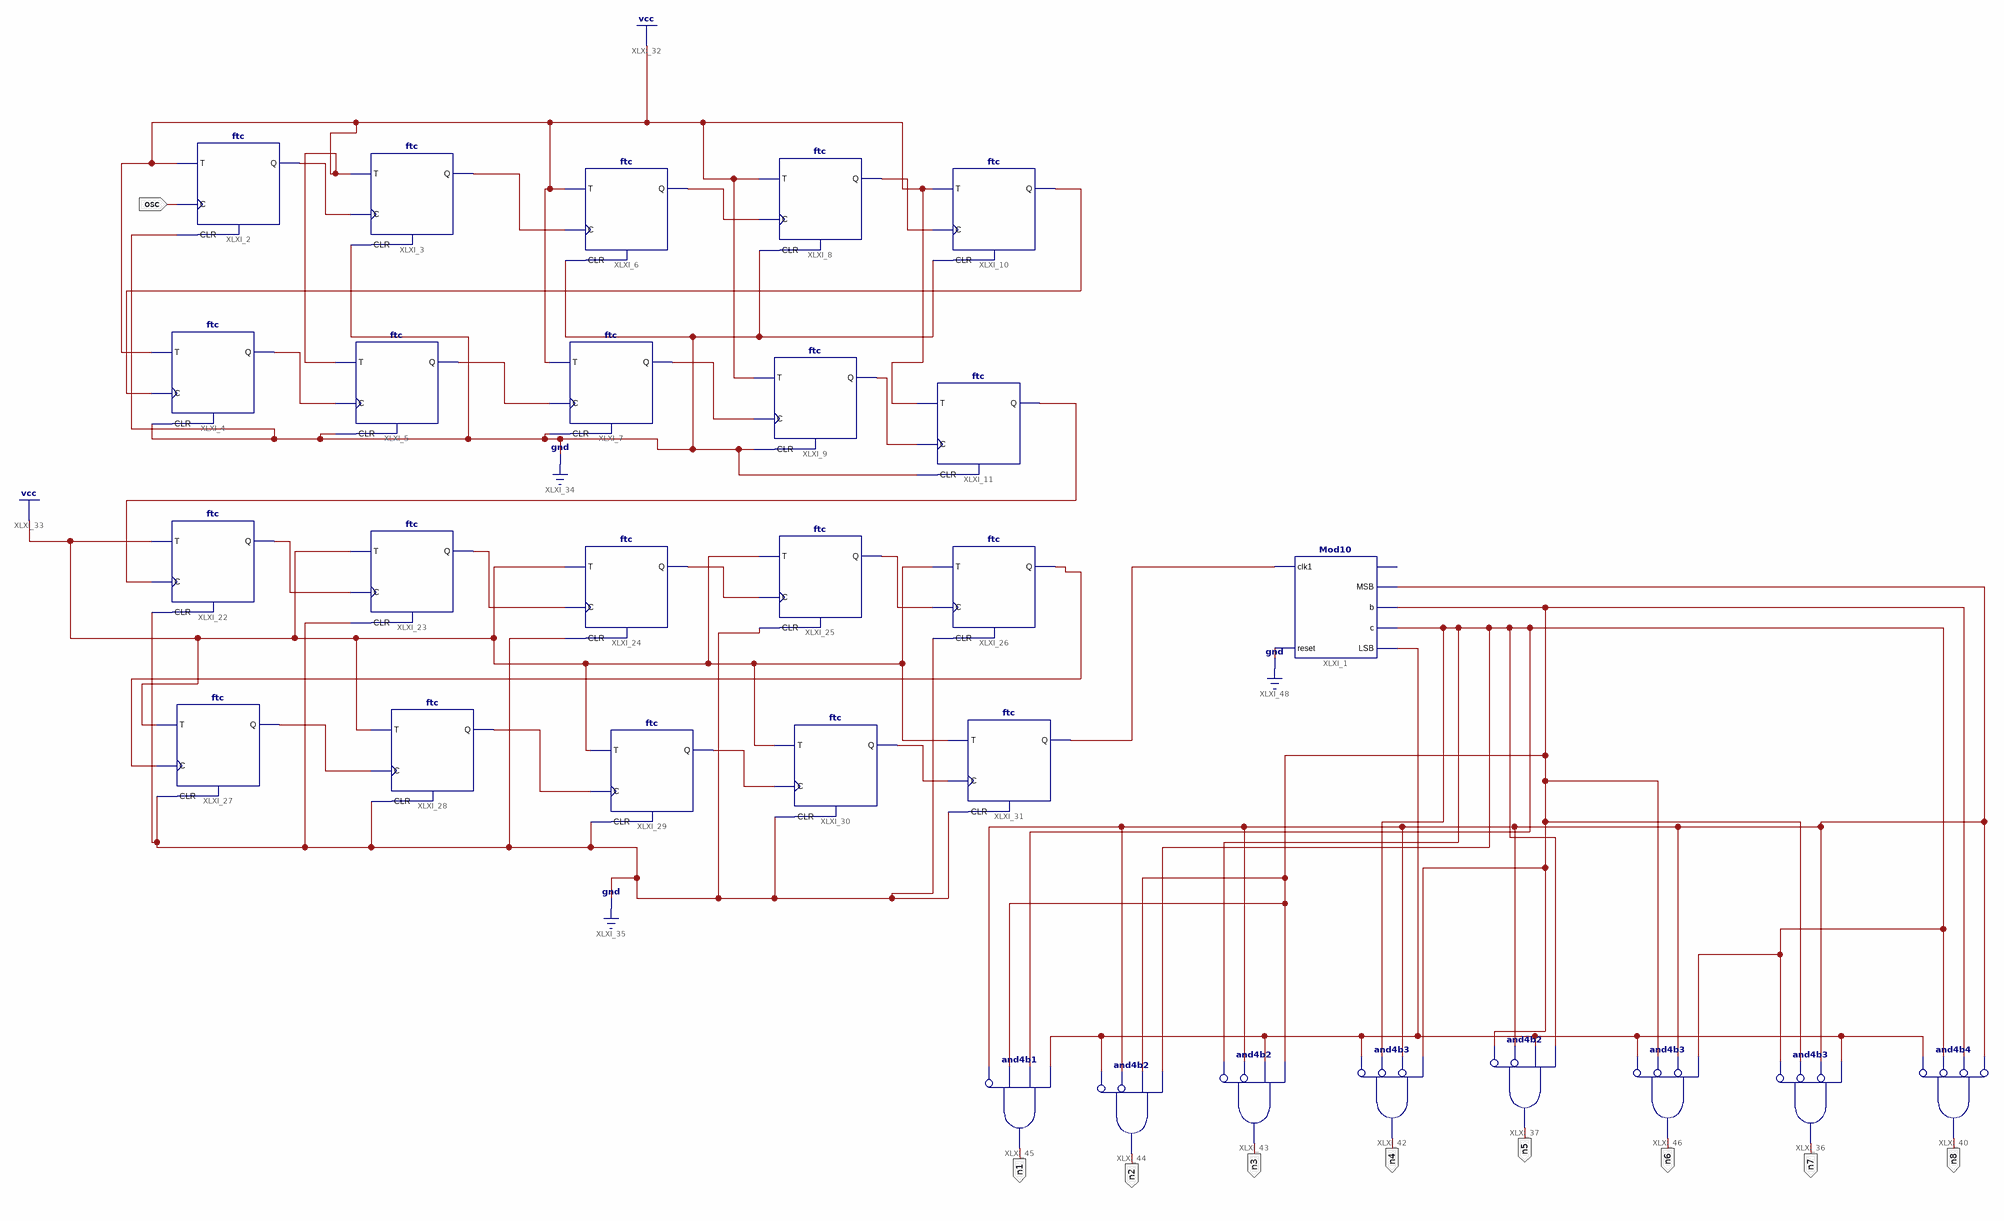
[diagram p0: schematic sheet 1]
// Xilinx ISE schematic testlab3.sch (spartan6) as structural Verilog: 29 symbols, 9 ports
module testlab3 (
  input  osc,
  output n8,
  output n7,
  output n6,
  output n5,
  output n4,
  output n3,
  output n2,
  output n1
);

  wire XLXN_4, XLXN_6, XLXN_8, XLXN_9, XLXN_10, XLXN_14, XLXN_15, XLXN_16, XLXN_17, XLXN_30, XLXN_32,
       XLXN_33, XLXN_34, XLXN_35, XLXN_36, XLXN_37, XLXN_38, XLXN_40, XLXN_41, XLXN_53, XLXN_66, XLXN_72,
       XLXN_79, XLXN_80;

  Mod10 XLXI_1 (.clk1(XLXN_53), .reset(1'b0), .MSB(XLXN_66), .b(XLXN_72), .c(XLXN_79), .LSB(XLXN_80));  // open: C_end
  ftc XLXI_2 (.C(osc), .CLR(1'b0), .T(1'b1), .Q(XLXN_4));
  ftc XLXI_3 (.C(XLXN_4), .CLR(1'b0), .T(1'b1), .Q(XLXN_6));
  ftc XLXI_4 (.C(XLXN_10), .CLR(1'b0), .T(1'b1), .Q(XLXN_14));
  ftc XLXI_5 (.C(XLXN_14), .CLR(1'b0), .T(1'b1), .Q(XLXN_15));
  ftc XLXI_6 (.C(XLXN_6), .CLR(1'b0), .T(1'b1), .Q(XLXN_8));
  ftc XLXI_7 (.C(XLXN_15), .CLR(1'b0), .T(1'b1), .Q(XLXN_16));
  ftc XLXI_8 (.C(XLXN_8), .CLR(1'b0), .T(1'b1), .Q(XLXN_9));
  ftc XLXI_9 (.C(XLXN_16), .CLR(1'b0), .T(1'b1), .Q(XLXN_17));
  ftc XLXI_10 (.C(XLXN_9), .CLR(1'b0), .T(1'b1), .Q(XLXN_10));
  ftc XLXI_11 (.C(XLXN_17), .CLR(1'b0), .T(1'b1), .Q(XLXN_30));
  ftc XLXI_22 (.C(XLXN_30), .CLR(1'b0), .T(1'b1), .Q(XLXN_32));
  ftc XLXI_23 (.C(XLXN_32), .CLR(1'b0), .T(1'b1), .Q(XLXN_33));
  ftc XLXI_24 (.C(XLXN_33), .CLR(1'b0), .T(1'b1), .Q(XLXN_34));
  ftc XLXI_25 (.C(XLXN_34), .CLR(1'b0), .T(1'b1), .Q(XLXN_35));
  ftc XLXI_26 (.C(XLXN_35), .CLR(1'b0), .T(1'b1), .Q(XLXN_36));
  ftc XLXI_27 (.C(XLXN_36), .CLR(1'b0), .T(1'b1), .Q(XLXN_37));
  ftc XLXI_28 (.C(XLXN_37), .CLR(1'b0), .T(1'b1), .Q(XLXN_38));
  ftc XLXI_29 (.C(XLXN_38), .CLR(1'b0), .T(1'b1), .Q(XLXN_40));
  ftc XLXI_30 (.C(XLXN_40), .CLR(1'b0), .T(1'b1), .Q(XLXN_41));
  ftc XLXI_31 (.C(XLXN_41), .CLR(1'b0), .T(1'b1), .Q(XLXN_53));
  and XLXI_36 (n7, ~XLXN_79, ~XLXN_72, ~XLXN_66, XLXN_80);  // and4b3
  and XLXI_37 (n5, ~XLXN_72, ~XLXN_66, XLXN_80, XLXN_79);  // and4b2
  and XLXI_40 (n8, ~XLXN_80, ~XLXN_79, ~XLXN_72, ~XLXN_66);  // and4b4
  and XLXI_42 (n4, ~XLXN_80, ~XLXN_79, ~XLXN_66, XLXN_72);  // and4b3
  and XLXI_43 (n3, ~XLXN_79, ~XLXN_66, XLXN_80, XLXN_72);  // and4b2
  and XLXI_44 (n2, ~XLXN_80, ~XLXN_66, XLXN_72, XLXN_79);  // and4b2
  and XLXI_45 (n1, ~XLXN_66, XLXN_72, XLXN_79, XLXN_80);  // and4b1
  and XLXI_46 (n6, ~XLXN_80, ~XLXN_72, ~XLXN_66, XLXN_79);  // and4b3
endmodule
